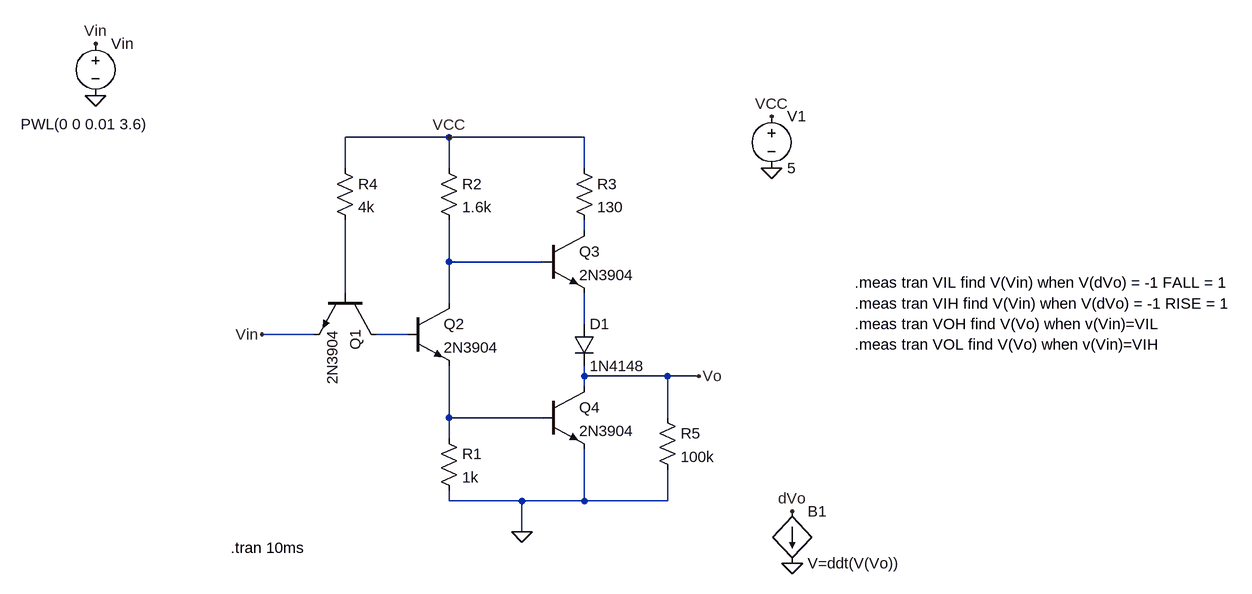
[diagram p0: schematic TTL_inverter.asc]
TTL_inverter.asc, the LTspice schematic file:
Version 4
SHEET 1 1736 680
WIRE 480 -192 320 -192
WIRE 688 -192 480 -192
WIRE 320 -144 320 -192
WIRE 480 -144 480 -192
WIRE 688 -144 688 -192
WIRE 688 -48 688 -64
WIRE 480 0 480 -64
WIRE 624 0 480 0
WIRE 320 48 320 -64
WIRE 480 64 480 0
WIRE 688 96 688 48
WIRE 272 112 192 112
WIRE 416 112 368 112
WIRE 688 176 688 160
WIRE 816 176 688 176
WIRE 864 176 816 176
WIRE 688 192 688 176
WIRE 480 240 480 160
WIRE 624 240 480 240
WIRE 816 240 816 176
WIRE 480 272 480 240
WIRE 480 368 480 352
WIRE 592 368 480 368
WIRE 688 368 688 288
WIRE 688 368 592 368
WIRE 816 368 816 320
WIRE 816 368 688 368
WIRE 592 416 592 368
FLAG 592 416 0
FLAG 864 176 Vo
FLAG 192 112 Vin
FLAG 976 -144 0
FLAG 976 -224 VCC
FLAG 480 -192 VCC
FLAG -64 -256 0
FLAG -64 -336 Vin
FLAG 1008 464 0
FLAG 1008 384 dVo
SYMBOL npn 368 48 R90
SYMATTR InstName Q1
SYMATTR Value 2N3904
SYMBOL npn 416 64 R0
SYMATTR InstName Q2
SYMATTR Value 2N3904
SYMBOL npn 624 -48 R0
SYMATTR InstName Q3
SYMATTR Value 2N3904
SYMBOL npn 624 192 R0
SYMATTR InstName Q4
SYMATTR Value 2N3904
SYMBOL diode 672 96 R0
SYMATTR InstName D1
SYMATTR Value 1N4148
SYMBOL res 464 256 R0
SYMATTR InstName R1
SYMATTR Value 1k
SYMBOL res 464 -160 R0
SYMATTR InstName R2
SYMATTR Value 1.6k
SYMBOL res 672 -160 R0
SYMATTR InstName R3
SYMATTR Value 130
SYMBOL res 304 -160 R0
SYMATTR InstName R4
SYMATTR Value 4k
SYMBOL voltage 976 -240 R0
WINDOW 123 0 0 Left 0
WINDOW 39 0 0 Left 0
SYMATTR InstName V1
SYMATTR Value 5
SYMBOL voltage -64 -352 R0
WINDOW 123 0 0 Left 0
WINDOW 39 0 0 Left 0
WINDOW 3 -115 140 Left 2
SYMATTR Value PWL(0 0 0.01 3.6)
SYMATTR InstName Vin
SYMBOL res 800 224 R0
SYMATTR InstName R5
SYMATTR Value 100k
SYMBOL bi 1008 384 R0
SYMATTR InstName B1
SYMATTR Value V=ddt(V(Vo))
TEXT 144 440 Left 2 !.tran 10ms
TEXT 1104 32 Left 2 !.meas tran VIL find V(Vin) when V(dVo) = -1 FALL = 1
TEXT 1104 64 Left 2 !.meas tran VIH find V(Vin) when V(dVo) = -1 RISE = 1
TEXT 1104 96 Left 2 !.meas tran VOH find V(Vo) when v(Vin)=VIL\n.meas tran VOL find V(Vo) when v(Vin)=VIH

The netlist it stands for:
* TTL_inverter.asc
Q1 N005 N003 Vin 0 2N3904
Q2 N002 N005 N006 0 2N3904
Q3 N001 N002 N004 0 2N3904
Q4 Vo N006 0 0 2N3904
D1 N004 Vo 1N4148
R1 N006 0 1k
R2 VCC N002 1.6k
R3 VCC N001 130
R4 VCC N003 4k
V1 VCC 0 5
Vin Vin 0 PWL(0 0 0.01 3.6)
R5 Vo 0 100k
B1 dVo 0 V=ddt(V(Vo))
.model D D
.lib standard.dio
.model NPN NPN
.model PNP PNP
.lib standard.bjt
.tran 10ms
.meas tran VIL find V(Vin) when V(dVo) = -1 FALL = 1
.meas tran VIH find V(Vin) when V(dVo) = -1 RISE = 1
.meas tran VOH find V(Vo) when v(Vin)=VIL
.meas tran VOL find V(Vo) when v(Vin)=VIH
.backanno
.end